# EAGLE design PDB (EAGLE 8.3.2)

## Sheet 1 of 2
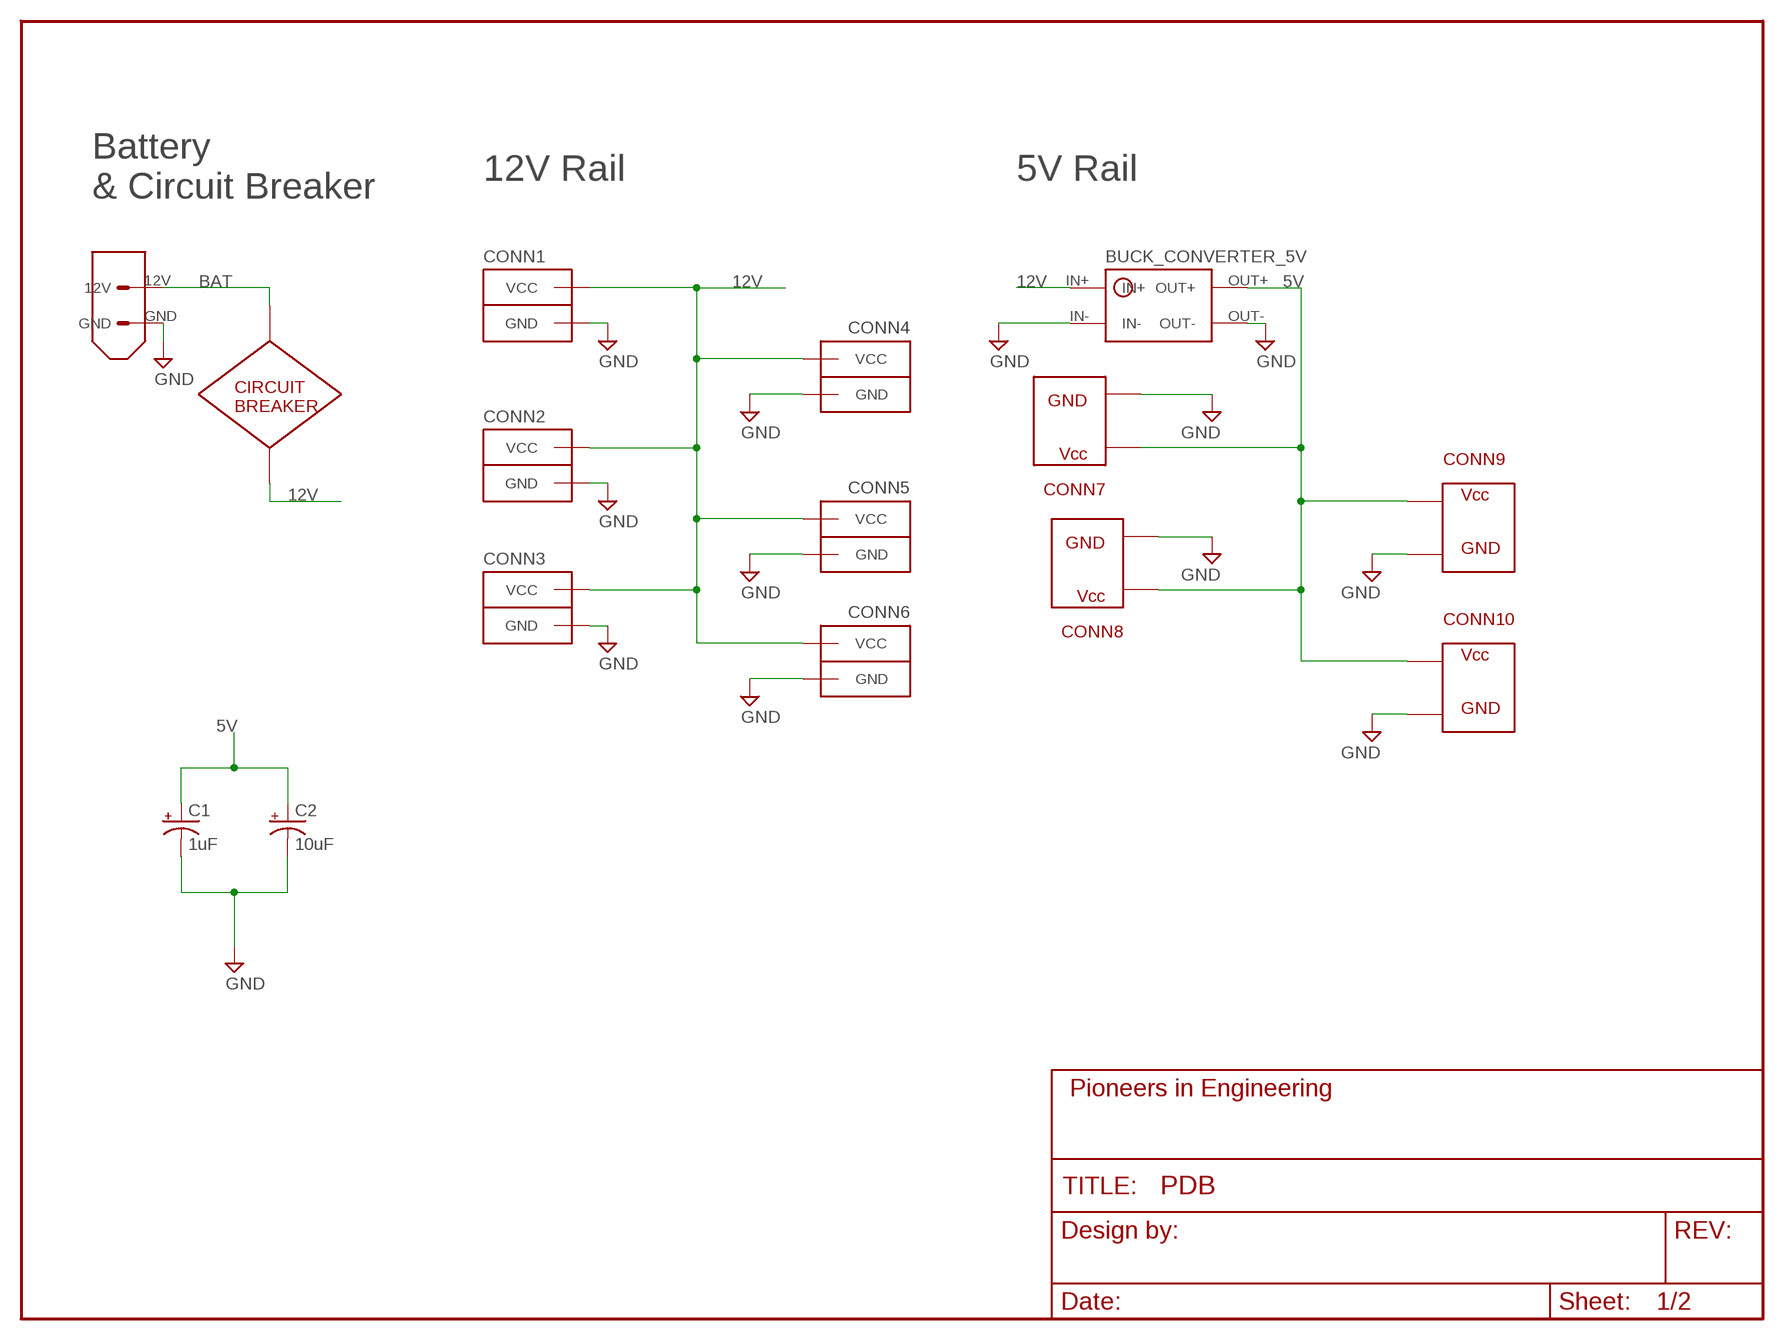
[diagram p0: schematic, sheet 1]
FRAME1 (FRAME_SCHEMATIC): AUTHOR: Mohammed H., Sharabesh R., Tobin H.; REVISION: 10C

### Parts
C1  1uF  CPOL-USE5-5  [E5-5]
C2  10uF  CPOL-USE5-5  [E5-5]
CIRCUIT_BREAKER  CIRC_BREAKER  [CIRC_BREAKER]
CONN1  ANDERSONVERTICAL  [ANDERSON_VERTICAL]
CONN2  ANDERSONVERTICAL  [ANDERSON_VERTICAL]
CONN3  ANDERSONVERTICAL  [ANDERSON_VERTICAL]
CONN4  ANDERSONVERTICAL  [ANDERSON_VERTICAL]
CONN5  ANDERSONVERTICAL  [ANDERSON_VERTICAL]
CONN6  ANDERSONVERTICAL  [ANDERSON_VERTICAL]
CONN7  ATX  [ATX]
CONN8  ATX  [ATX]
CONN9  ATX  [ATX]
CONN10  ATX  [ATX]
U$1  BUCK_CONVERTER_5V  [BUCK_CONVERTER_5V]
XT60  XT60CONNECTOR  [XT60CONNECTOR]

### Nets
5V: C1.+ C2.+ CONN7.P$1 CONN8.P$1 CONN9.P$1 CONN10.P$1 U$1.OUT+ ; also sheet 2
12V: CIRCUIT_BREAKER.P$2 CONN1.PIN2(VCC) CONN2.PIN2(VCC) CONN3.PIN2(VCC) CONN4.PIN2(VCC) CONN5.PIN2(VCC) CONN6.PIN2(VCC) U$1.IN+
BAT: CIRCUIT_BREAKER.P$1 XT60.12V
GND: C1.- C2.- CONN1.PIN1(GND) CONN2.PIN1(GND) CONN3.PIN1(GND) CONN4.PIN1(GND) CONN5.PIN1(GND) CONN6.PIN1(GND) CONN7.P$2 CONN8.P$2 CONN9.P$2 CONN10.P$2 U$1.IN- U$1.OUT- XT60.GND ; also sheet 2

### Notes on the sheet
- 12V Rail | 5V Rail
- Battery
  & Circuit Breaker

## Sheet 2 of 2
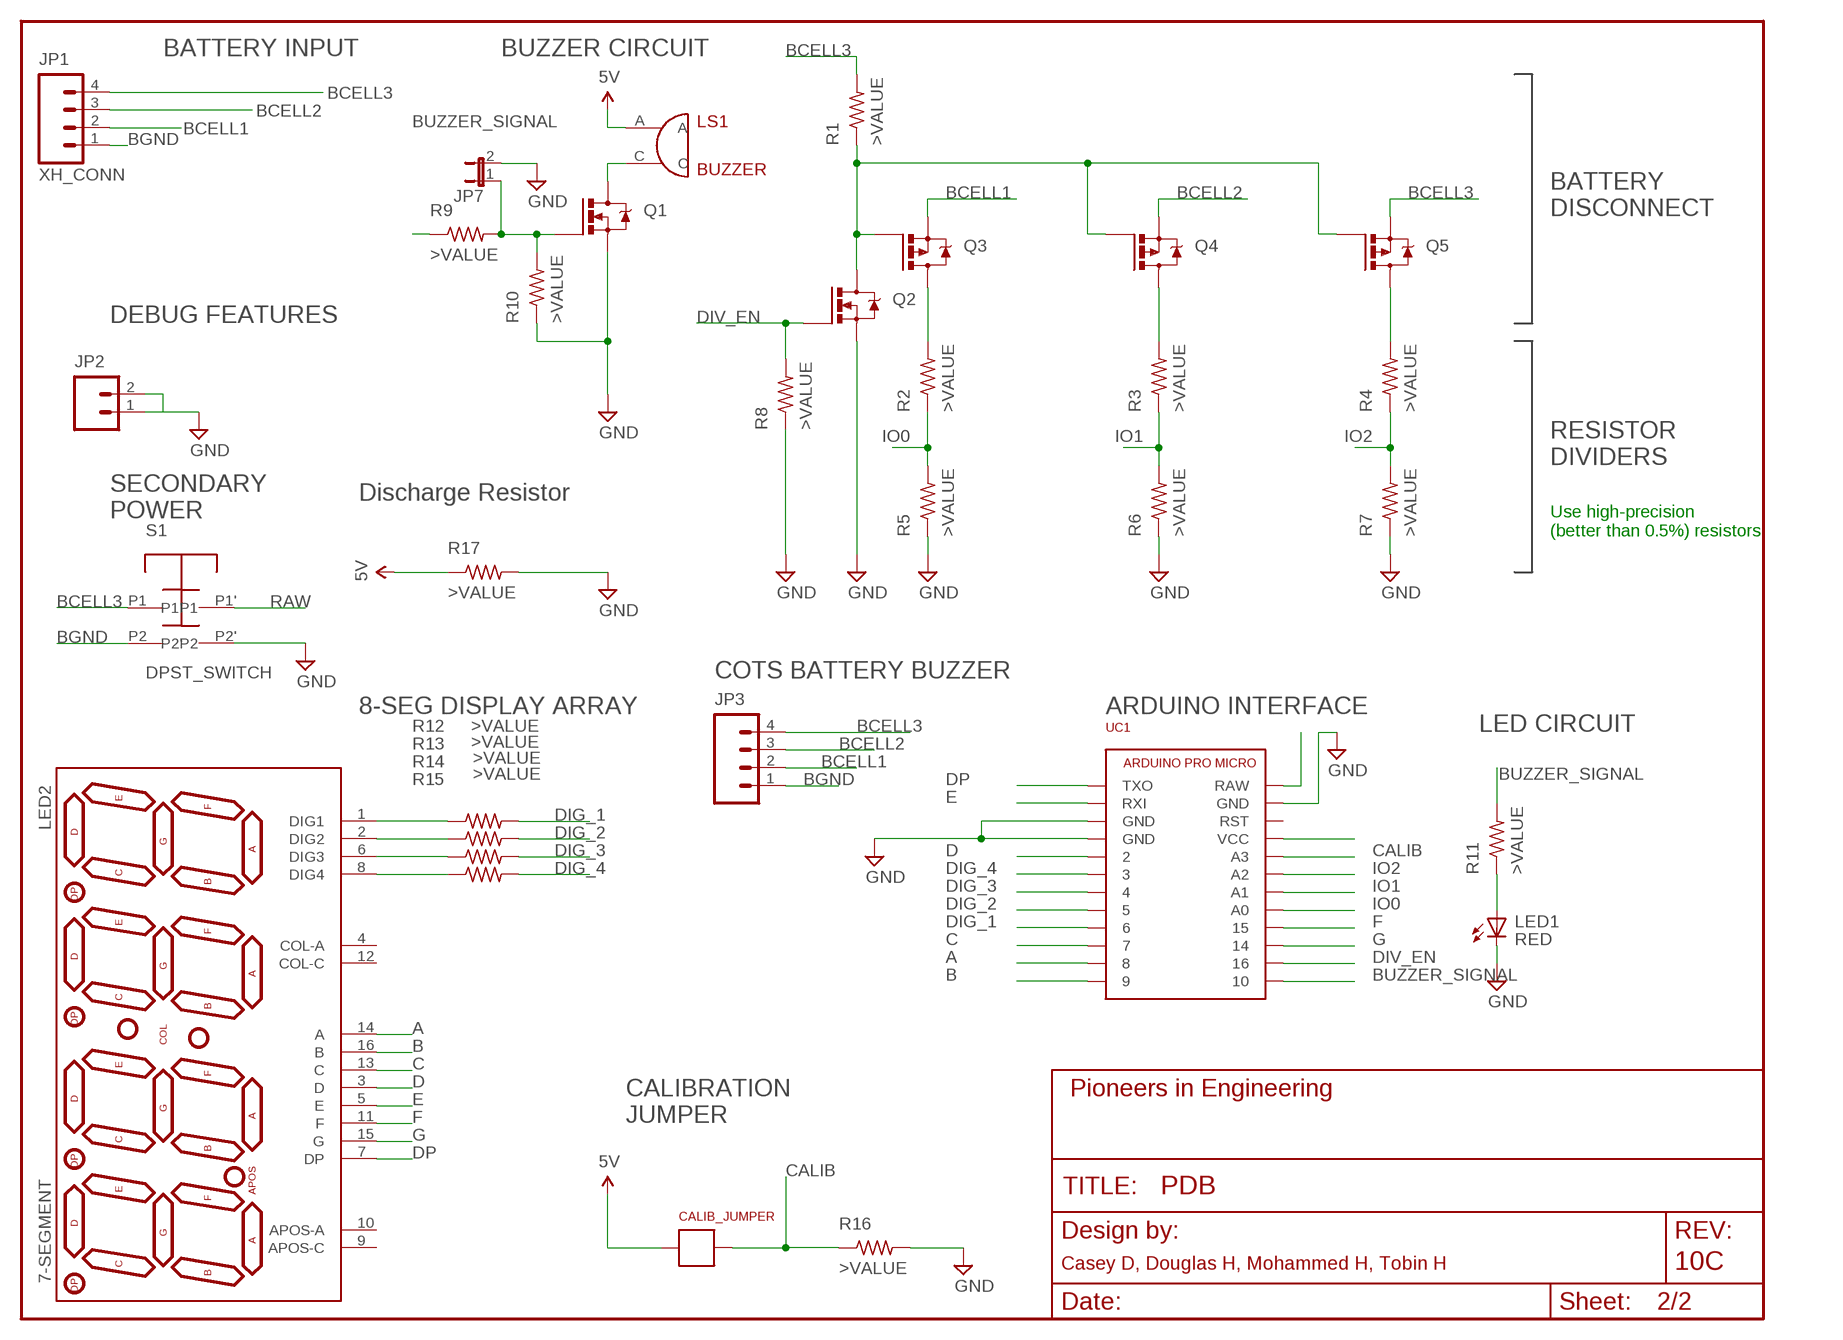
[diagram p1: schematic, sheet 2]
FRAME2 (FRAME_SCHEMATIC): AUTHOR: Casey D, Douglas H, Mohammed H, Tobin H; REVISION: 10C

### Parts
CALIB_JUMPER  JUMPER  [JUMPER]
JP1  XH_CONN  XH_CONNECTOR_4POS  [XH_CONNECTOR_4POS_2.5MM]
JP2  M02PTH  [1X02]
JP3  M04PTH  [1X04]
JP7  JP1E  [JP1]
LED1  RED  LED0805  [LED-0805]
LED2  7-SEGMENT  7-SEGMENT-4DIGIT-YOUNGSUN  [7-SEGMENT-4DIGIT-YOUNGSUN]
LS1  BUZZER  [BUZZER_MAGNETIC_5V_12MM_RADIAL]
Q1  NMOS  N-CHANNEL-MOSFETSOT23-3  [SOT23-3]
Q2  IRFML8244  N-CHANNEL-MOSFETSOT23-3  [SOT23-3]
Q3  PMOS  P-CHANNEL-MOSFETSOT23-3  [SOT23-3]
Q4  PMOS  P-CHANNEL-MOSFETSOT23-3  [SOT23-3]
Q5  PMOS  P-CHANNEL-MOSFETSOT23-3  [SOT23-3]
R1  >VALUE  R-US_R0603  [R0603]
R2  >VALUE  R-US_R0603  [R0603]
R3  >VALUE  R-US_R0603  [R0603]
R4  >VALUE  R-US_R0603  [R0603]
R5  >VALUE  R-US_R0603  [R0603]
R6  >VALUE  R-US_R0603  [R0603]
R7  >VALUE  R-US_R0603  [R0603]
R8  >VALUE  R-US_R0603  [R0603]
R9  >VALUE  R-US_R0603  [R0603]
R10  >VALUE  R-US_R0603  [R0603]
R11  >VALUE  R-US_R0603  [R0603]
R12  >VALUE  R-US_R0603  [R0603]
R13  >VALUE  R-US_R0603  [R0603]
R14  >VALUE  R-US_R0603  [R0603]
R15  >VALUE  R-US_R0603  [R0603]
R16  >VALUE  R-US_R0603  [R0603]
R17  >VALUE  R-US_R0603  [R0603]
S1  DPST_SWITCH  [C&K_SWITCH]
UC1  ARDUINO_PRO_MICRO  [ARDUINO_PRO_MICRO]

### Nets
5V: CALIB_JUMPER.P$1 LS1.A R17.1 UC1.VCC ; also sheet 1
A: LED2.14(A) UC1.8
B: LED2.16(B) UC1.9
BCELL1: JP1.2 JP3.2 Q3.2(S)
BCELL2: JP1.3 JP3.3 Q4.2(S)
BCELL3: JP1.4 JP3.4 Q5.2(S) R1.2 S1.P1
BGND: JP1.1 JP3.1 S1.P2
BUZZER_SIGNAL: R9.1 R11.2 UC1.10
C: LED2.13(C) UC1.7
CALIB: CALIB_JUMPER.P$2 R16.1 UC1.A3
D: LED2.3(D) UC1.2
DIG_1: R12.2 UC1.6
DIG_2: R13.2 UC1.5
DIG_3: R14.2 UC1.4
DIG_4: R15.2 UC1.3
DIV_EN: Q2.1(G) R8.2 UC1.16
DP: LED2.7(DP) UC1.TXO
E: LED2.5(E) UC1.RXI
F: LED2.11(F) UC1.15
G: LED2.15(G) UC1.14
GND: JP2.1 JP2.2 JP7.2 LED1.C Q1.2(S) Q2.2(S) R5.1 R6.1 R7.1 R8.1 R10.1 R16.2 R17.2 S1.P2' UC1.GND@0(GND) UC1.GND@1(GND) UC1.GND@2(GND) ; also sheet 1
IO0: R2.1 R5.2 UC1.A0
IO1: R3.1 R6.2 UC1.A1
IO2: R4.1 R7.2 UC1.A2
N$1: Q2.3(D) Q3.1(G) Q4.1(G) Q5.1(G) R1.1
N$2: Q3.3(D) R2.2
N$3: Q4.3(D) R3.2
N$4: Q5.3(D) R4.2
N$5: LS1.C Q1.3(D)
N$6: JP7.1 Q1.1(G) R9.2 R10.2
N$7: LED1.A R11.1
N$9: LED2.1(DIG1) R12.1
N$11: LED2.2(DIG2) R13.1
N$13: LED2.6(DIG3) R14.1
N$15: LED2.8(DIG4) R15.1
RAW: S1.P1' UC1.RAW
Unconnected: LED2.4(COL-A) LED2.9(APOS-C) LED2.10(APOS-A) LED2.12(COL-C) UC1.RST

### Notes on the sheet
- BATTERY INPUT | BUZZER CIRCUIT
- BATTERY
  DISCONNECT
- DEBUG FEATURES
- RESISTOR
  DIVIDERS
- Discharge Resistor
- SECONDARY
  POWER
- Use high-precision
  (better than 0.5%) resistors
- COTS BATTERY BUZZER
- 8-SEG DISPLAY ARRAY | ARDUINO INTERFACE
- Connect BCELL3 to RAW, which
  will get regulated on the arduino.
- LED CIRCUIT
- CALIBRATION
  JUMPER

## Library data of the parts
C1 C2 = rcl:CPOL-US: POLARIZED CAPACITOR, American symbol
CALIB_JUMPER = pie:JUMPER: 2 Pin Jumper; DESCRIPTION: JUMPER; DISTRIBUTOR: DigiKey; DISTRIBUTOR_PART_NUMBER: 952-2262-ND; MANUFACTURER: Harwin. Inc; MANUFACTURER_PART_NUMBER: M20-9990246; PACKAGE: JP
CIRCUIT_BREAKER = pie:CIRC_BREAKER: PiE Circuit Breaker: product page <http://www.waytekwire.com/item/46977/Bussmann-25550-B-2-Mid-Range-Circuit-Breaker-/>; MANUF: WAYTEK; MANUF-PN: 46977
CONN1-CONN6 = pie:ANDERSON: 2-pin 25A Anderson Connector http://www.alliedelec.com/images/products/datasheets/bm/ANDERSON_POWER_PRODUCTS/70162018.pdf; PIE-INT-REF-NUM: Anderson
CONN7-CONN10 = pie:ATX: ATX 2 Pin Connector Crimper: http://www.digikey.com/product-detail/en/molex-llc/0640160204/WM17553-ND/2074099 Housing: http://www.digikey.com/product-detail/en/molex-llc/0019092029/WM4382-ND/2421313 Housing (alternative): http://www.digikey.com/product-detail/en/molex-llc/0015311026/WM1041-ND/313614 Connector: http://www.digikey.com/product-detail/en/molex-llc/0019091029/WM1602-ND/26354 Male crimps: http://www.digikey.com/product-detail/en/molex-llc/0002092103/WM1100-ND/26384 Female crimps: http://www.digikey.com/product-detail/en/molex-llc/0002091104/WM1101-ND/26386
JP1 = pie:XH_CONNECTOR_4POS: 4-pin XH connector (through-hole type shrouded header); PIE-INT-REF-NUM: XH-4POS; PIE_DIGIKEY-PN: 455-2249-ND
JP2 = pie:M02: 2-pin 0.1-inch header and MTA connector; PIE-INT-REF-NUM: BULK-STOCK
JP3 = pie:M04: 4-pin 0.1-inch header and MTA connector; PIE-INT-REF-NUM: BULK-STOCK
JP7 = jumper:JP1E: JUMPER
LED1 = pie:LED: LEDs Standard schematic elements and footprints for 5mm, 3mm, 1206, and 0603 sized LEDs. 5mm - Spark Fun Electronics SKU : COM-00529 (and others); PIE-INT-REF-NUM: LED
LED2 = pie:7-SEGMENT-4DIGIT-YOUNGSUN: This is a part for the 4-Digit 7-segment LEDs from Young Sun. Different from the Digikey LEDs, all 16 pins are used. The LONGPADS Variant is used for a test jig, but you may like it because there is more pad to solder to. If you are concerned about routing space, the standard works just fine though.
LS1 = pie:BUZZER: Buzzer; PIE-INT-REF-NUM: BUZZER; PIE_DIGIKEY-PN: 102-1269-ND
Q1 Q2 = pie:N-CHANNEL-MOSFET: N-channel TrenchMOS (TM) logic level FET Source: SOT23-3: http://www.nxp.com/documents/data_sheet/BSS123.pdf SOT669: http://www.nxp.com/documents/data_sheet/PH7030L.pdf
Q3-Q5 = pie:P-CHANNEL-MOSFET: P-Channel PowerTrench® MOSFET Source: FDD4141.pdf; PIE-DIGIKEY-PN-PRI: IRLML6402PBFCT-ND; PIE-INT-REF-NUM: PMOS
R1-R17 = pie:R-US_: RESISTOR, American symbol; DESCRIPTION: RESISTOR, American symbol; DISTRIBUTOR: DigiKey; MANUFACTURER: Rohm Semiconductor; NOTES: Cut Tape; PACKAGE: R0603
S1 = pie:DPST_SWITCH: Double Throw, single pole normally open pushbutton switch. 401-1133-ND
U$1 = pie:BUCK_CONVERTER_5V: 5V Buck Converter. For PDB. Product Detail <https://www.amazon.com/dp/B00GQ032DK/?psc=1>
UC1 = pie:ARDUINO_PRO_MICRO: Arduino Pro Micro Electrical System Year 9's Smart Sensor Core Pin Outs <https://cdn.sparkfun.com/assets/9/c/3/c/4/523a1765757b7f5c6e8b4567.png> Buy Here <http://www.aliexpress.com/item/Mini-Leonardo-Pro-Micro-ATmega32U4-5V-16MHz-Module-For-Arduino-Best-Quality/32284746884.html?ws_ab_test=searchweb201556_8,searchweb201602_2_10057_10056_10065_10055_10054_10067_10069_10059_10058_10017_10070_10060_10061_10052_10062_10053_10050_10051,searchweb201603_1&btsid=45993952-29ca-4de4-a0fb-c7fb72b8e1a5> Thru Hole Female Pins <http://www.digikey.com/product-search/en?keywords=929974E-01-12-ND> Surface Mount Female Pins <http://www.digikey.com/product-detail/en/sullins-connector-solutions/NPTC121KFXC-RC/S5604-ND/776062>; DESCRIPTION: Arduino Pro Micro; DISTRIBUTOR: AliExpress; DISTRIBUTOR_PART_NUMBER: 32284746884; MANUFACTURER: Feiyang electronics; NOTES: https://www.aliexpress.com/item/Mini-Leonardo-Pro-Micro-ATmega32U4-5V-16MHz-Module-For-Arduino-Best-Quality/32284746884.html?ws_ab_test=searchweb201556_8,searchweb201602_2_10057_10056_10065_10055_10054_10067_10069_10059_10058_10017_10070_10060_10061_10052_10062_10053_10050_10051,searchweb201603_1&btsid=45993952-29ca-4de4-a0fb-c7fb72b8e1a5; PACKAGE: ARDUINO_PRO_MICRO; REFERENCE_DEST: ARDUINO_PRO_MICRO
XT60 = pie:XT60CONNECTOR: 12V XT60 power connector; PARTNUMBER: PRT-10474

## Board
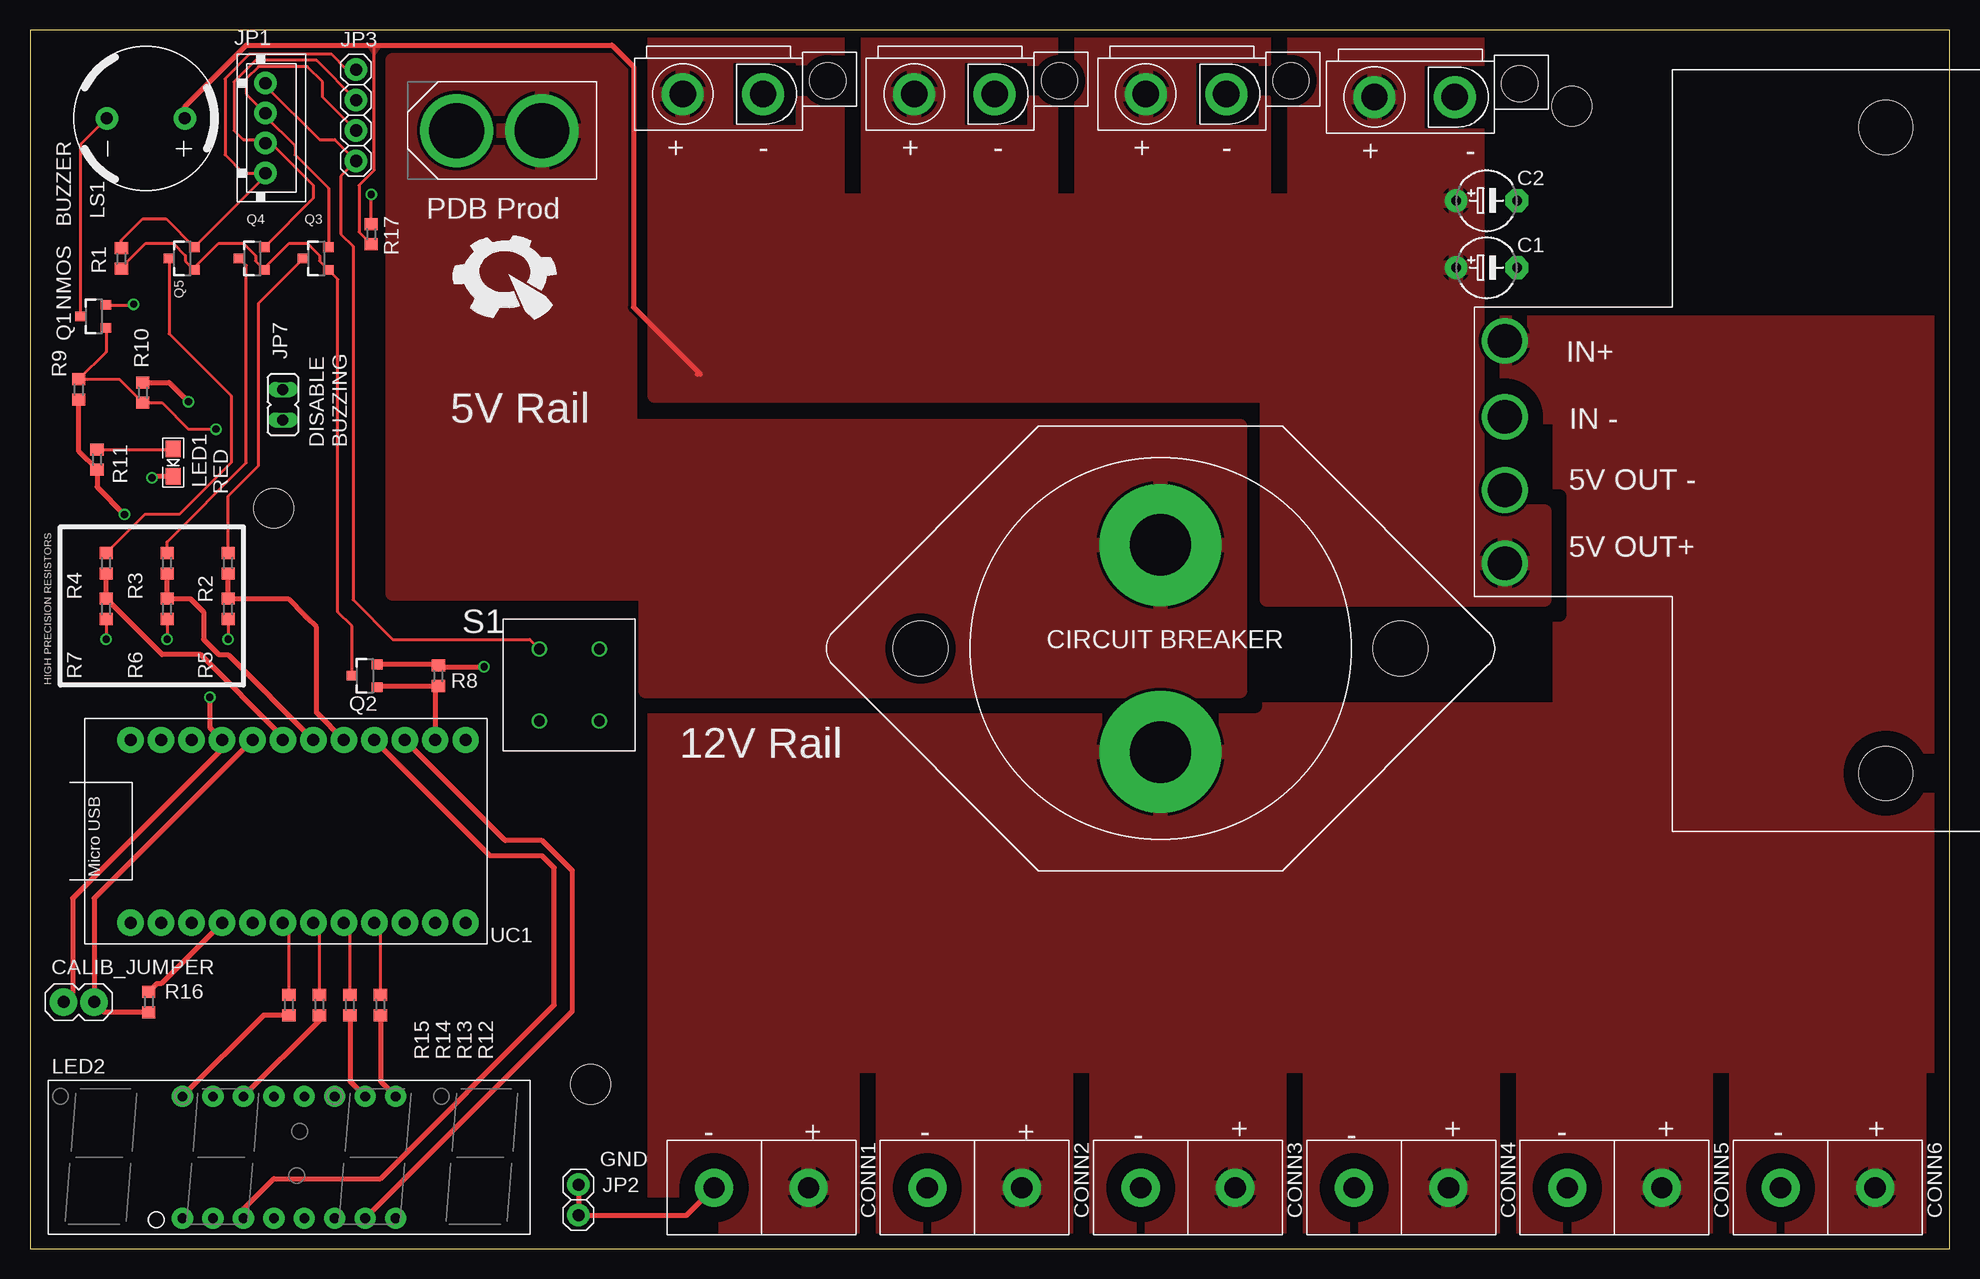
[diagram p2: board, top side]
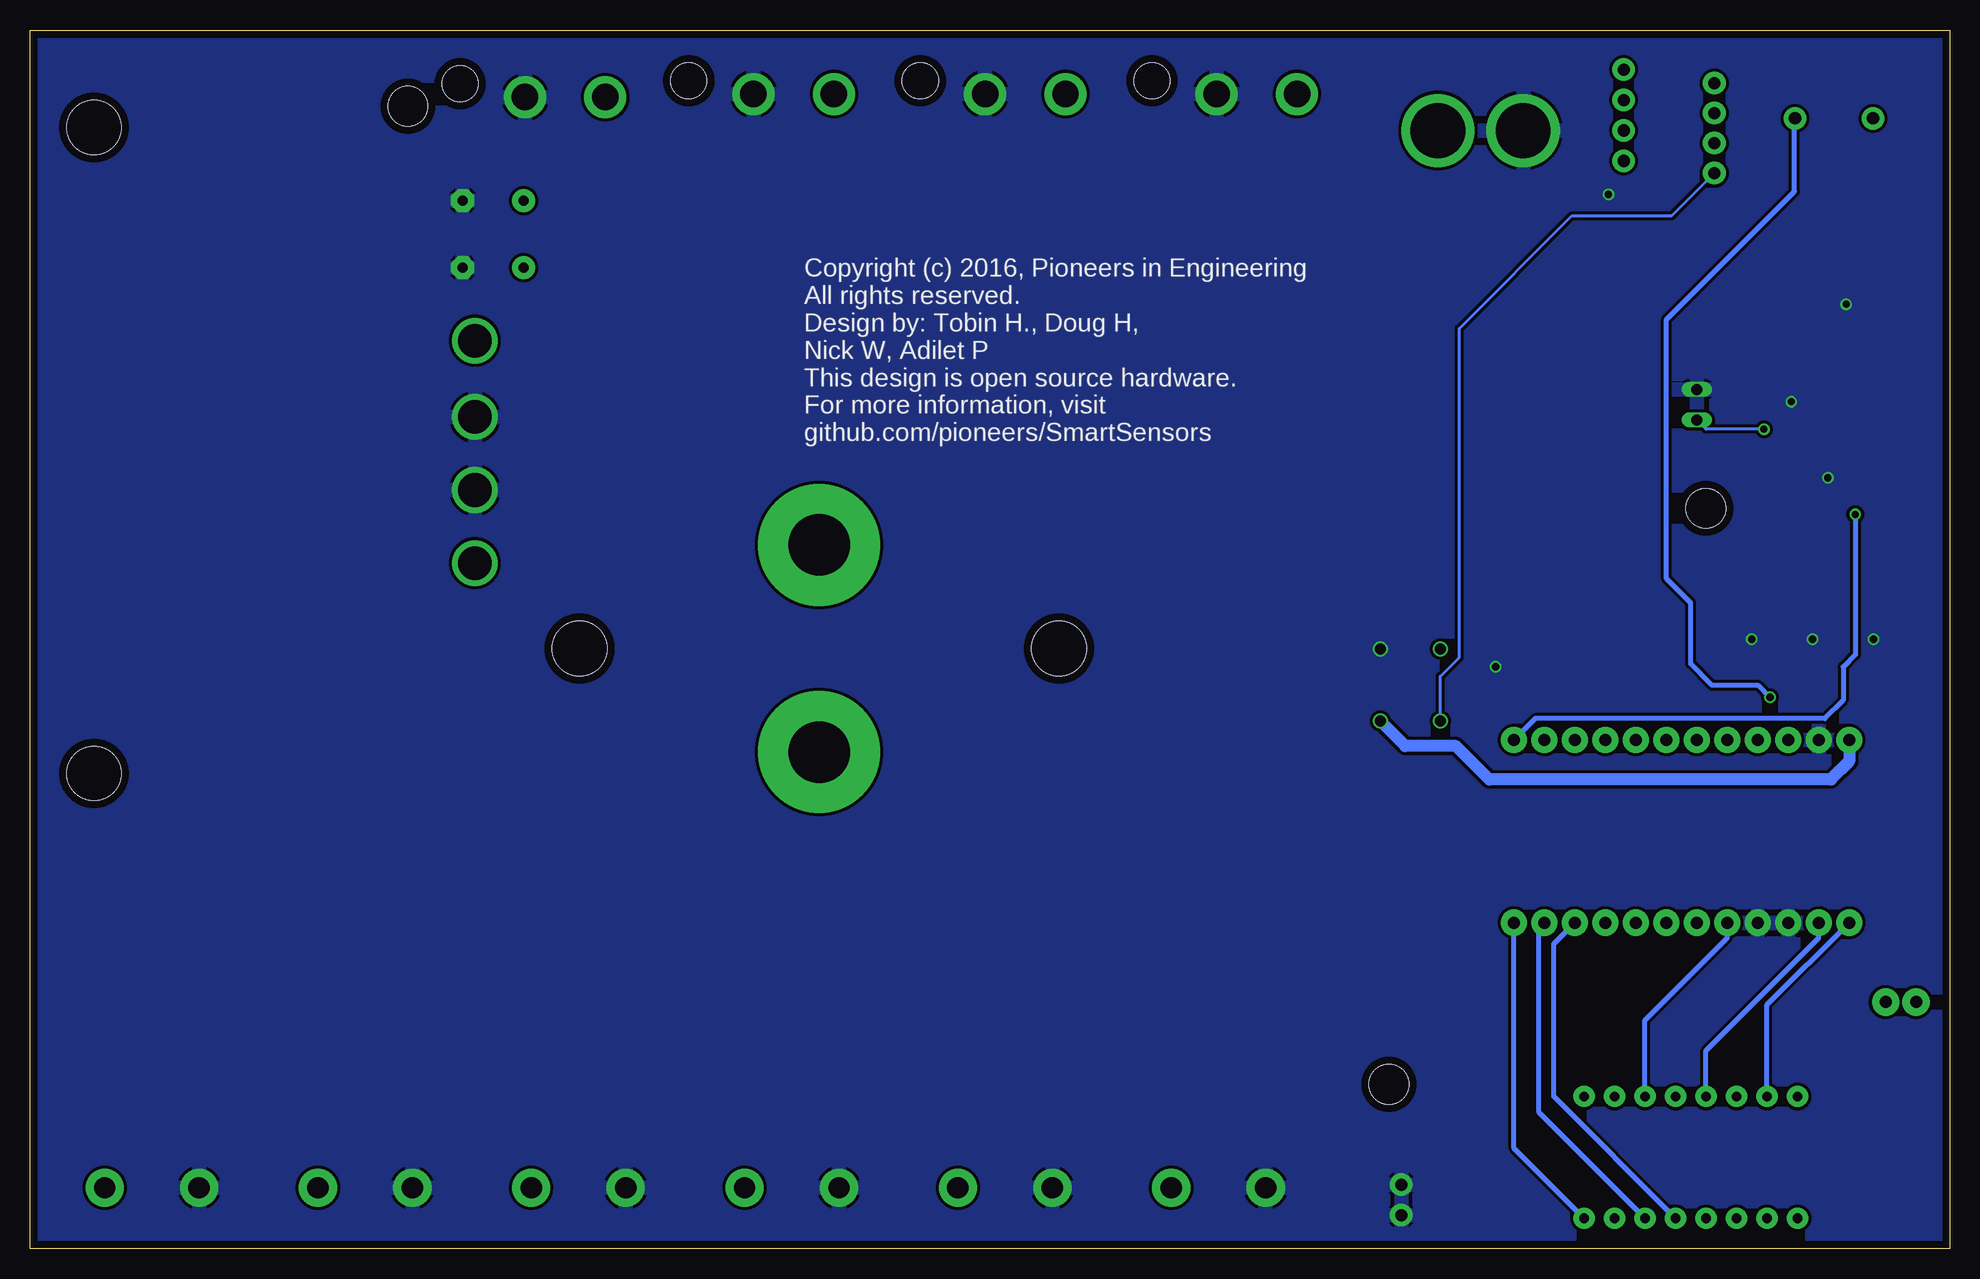
[diagram p3: board, bottom side, seen from below]

Size 160.02 x 101.6 mm. Coordinates in mm from the lower left corner, seen from the top.
Outline: 0,0 160.02,0 160.02,101.6 0,101.6 0,0
Copper layers (1*16): Top 2mil / dielectric 9mil / Bottom 2mil
Design rules "pie-2oz": minimum track width 10mil, minimum drill 15mil, track to track 10mil, track to pad 10mil, pad to pad 10mil, via to via 10mil, smd to smd 10mil, copper to edge 25mil, drill to drill 10mil, minimum pad ring 7mil, minimum via ring 7mil, stop-mask expansion 3mil, vias tented up to drill 21mil, thermal gap 10mil

### Footprints (pad centres in the part's own frame; a part is rotated, then mirrored left to right if it is on the bottom)
E5-5 = drill 0.813 pad 1.905: + -2.54,0 | drill 0.813 pad 1.905 octagon: - 2.54,0
JUMPER = drill 1 pad 2.286: P$1 -1.27,0; P$2 1.27,0
CIRC_BREAKER = drill 5.105 pad 10.16: P$1 0,8.636; P$2 0,-8.636 | hole 4.572: -19.99,0; 19.99,0
ANDERSON_VERTICAL = drill 1.778 pad 3.175: PIN1 0,-3.937; PIN2 0,3.937
ATX = drill 2.2 pad 3.5: P$1 -3,0; P$2 3.7,0 | hole 3: 9.1,1.1
XH_CONNECTOR_4POS_2.5MM = drill 1.016 pad 1.88: 1 -3.95,-0.19; 2 -1.45,-0.19; 3 1.05,-0.19; 4 3.55,-0.19
1X02 = drill 1.016 pad 1.88: 1 -1.27,0; 2 1.27,0
1X04 = drill 1.016 pad 1.88: 1 -3.81,0; 2 -1.27,0; 3 1.27,0; 4 3.81,0
JP1 = drill 0.914 long: 1 0,-1.27; 2 0,1.27
LED-0805 = smd 1.397 x 1.245: A -1.143,0; C 1.143,0
7-SEGMENT-4DIGIT-YOUNGSUN = drill 0.8 pad 1.778: 1 -8.89,-5.08; 2 -6.35,-5.08; 3 -3.81,-5.08; 4 -1.27,-5.08; 5 1.27,-5.08; 6 3.81,-5.08; 7 6.35,-5.08; 8 8.89,-5.08; 9 8.89,5.08; 10 6.35,5.08; 11 3.81,5.08; 12 1.27,5.08; 13 -1.27,5.08; 14 -3.81,5.08; 15 -6.35,5.08; 16 -8.89,5.08
BUZZER_MAGNETIC_5V_12MM_RADIAL = drill 1.016 pad 1.88: A 0,3.25; C 0,-3.25
SOT23-3 = smd 0.8 x 0.9: 1 -0.95,-1; 2 0.95,-1; 3 0,1.1
R0603 = smd 1 x 1.1: 1 -0.85,0; 2 0.85,0
C&K_SWITCH = drill 0.9: P1 -3,2.5; P1' -3,-2.5; P2 3,2.5; P2' 3,-2.5
BUCK_CONVERTER_5V = drill 2.8 pad 3.81: IN+ 9.144,31.75; IN- 2.794,31.75; OUT+ -9.398,31.75; OUT- -3.302,31.75 | hole 4.496: -26.924,0; 26.924,0
STAND-OFF = hole 3.302: 0,0
ARDUINO_PRO_MICRO = drill 1 pad 2.184: 2 1.778,19.558; 3 1.778,17.018; 4 1.778,14.478; 5 1.778,11.938; 6 1.778,9.398; 7 1.778,6.858; 8 1.778,4.318; 9 1.778,1.778; 10 17.018,1.778; 14 17.018,6.858; 15 17.018,9.398; 16 17.018,4.318; A0 17.018,11.938; A1 17.018,14.478; A2 17.018,17.018; A3 17.018,19.558; GND@0 1.778,24.638; GND@1 1.778,22.098; GND@2 17.018,27.178; RAW 17.018,29.718; RST 17.018,24.638; RXI 1.778,27.178; TXO 1.778,29.718; VCC 17.018,22.098
XT60CONNECTOR = drill 4.572 pad 6.096: 12V -3.556,0; GND 3.556,0

### Placement (x,y rotation side)
C1  121.41,81.79 0 top
C2  121.41,87.38 0 top
CALIB_JUMPER  4.06,20.57 0 top
CIRCUIT_BREAKER  94.23,50.04 0 top
CONN1  60.96,5.08 270 top
CONN2  78.74,5.08 270 top
CONN3  96.52,5.08 270 top
CONN4  114.3,5.08 270 top
CONN5  132.08,5.08 270 top
CONN6  149.86,5.08 270 top
CONN7  57.4,96.27 0 top
CONN8  96.01,96.27 0 top
CONN9  76.71,96.27 0 top
CONN10  115.06,96.01 0 top
JP1  19.81,93.22 270 top
JP2  45.72,4.06 90 top
JP3  27.18,94.49 90 top
JP7  21.08,70.36 0 top
LED1  11.94,65.53 270 top
LED2  21.59,7.62 180 top
LS1  9.65,94.23 270 top
Q1  5.33,77.72 90 top
Q2  27.94,47.75 90 top
Q3  23.88,82.55 90 top
Q4  18.54,82.55 90 top
Q5  12.7,82.55 90 top
R1  10k  [R0603]  7.62,82.55 90 top
R2  10k  [R0603]  16.51,57.15 90 top
R3  30k  [R0603]  11.43,57.15 90 top
R4  51k  [R0603]  6.35,57.15 90 top
R5  10k  [R0603]  16.51,53.34 90 top
R6  10k  [R0603]  11.43,53.34 90 top
R7  10k  [R0603]  6.35,53.34 90 top
R8  10k  [R0603]  34.04,47.75 270 top
R9  1k  [R0603]  4.06,71.63 90 top
R10  100k  [R0603]  9.4,71.37 270 top
R11  130  [R0603]  5.59,65.79 270 top
R12  330  [R0603]  29.21,20.32 90 top
R13  330  [R0603]  26.67,20.32 90 top
R14  330  [R0603]  24.13,20.32 90 top
R15  330  [R0603]  21.59,20.32 90 top
R16  10k  [R0603]  9.91,20.57 90 top
R17  3k  [R0603]  28.45,84.58 90 top
S1  44.96,46.99 90 top
U$1  154.69,66.55 90 top
U$2  [STAND-OFF]  46.74,13.72 0 top
U$4  [STAND-OFF]  128.52,95.25 90 top
U$5  [STAND-OFF]  20.32,61.72 0 top
U$6  [PIE-LOGO-SMALL]  39.88,81.28 0 top
UC1  38.1,25.4 90 top
XT60  39.12,93.22 180 top

### Tracks (layer width: path | path; a pad name or v marks a point on that pad's centre or on a via)
5V  (via drill 0.6)
  Top 0.254: R17.1 27.43,84.75 27.43,88.65 28.7,89.92 28.7,100.33
  Top 0.406: LS1.A 12.9,95.2 18.03,100.33 28.7,100.33 48.51,100.33 50.29,98.55 50.29,78.49 55.88,72.9 55.63,72.9 | v14.99,45.97 14.99,43.43 UC1.VCC 16,41.66 3.56,29.21 3.56,21.34 CALIB_JUMPER.P$1
  Bottom 0.406: LS1.A 12.95,94.18 12.95,88.14 23.62,77.47 23.62,55.88 21.59,53.85 21.59,48.77 19.81,46.99 16,46.99 v14.99,45.97
  pour Top: 52.07,87.38 120.65,87.38 120.65,61.47 126.24,61.47 126.24,54.1 103.12,54.1 103.12,71.12 52.07,71.12
  pour Top: 28.19,100.33 28.7,99.57 29.21,100.33
  pour Top: 52.07,101.6 67.31,101.6 67.31,85.34 52.07,85.34
  pour Top: 87.63,101.6 87.63,85.34 102.87,85.34 102.87,101.6
  pour Top: 69.85,101.6 69.85,85.34 85.09,85.34 85.09,101.6
  pour Top: 105.41,101.6 105.41,85.34 120.65,85.34 120.65,101.6
12V
  pour Top (isolate 1.27, rank 2): 52.07,44.96 127.51,44.96 127.51,69.34 121.92,69.34 121.92,77.22 158.75,77.22 158.75,15.24 52.07,15.24
  pour Top (isolate 1.27): 52.07,16.51 68.58,16.51 68.58,1.27 52.07,1.27
  pour Top (isolate 1.27): 106.68,1.27 121.92,1.27 121.92,16.51 106.68,16.51
  pour Top (isolate 1.27): 71.12,16.51 86.36,16.51 86.36,1.27 71.12,1.27
  pour Top (isolate 1.27): 124.46,1.27 139.7,1.27 139.7,16.51 124.46,16.51
  pour Top (isolate 1.27): 88.9,16.51 104.14,16.51 104.14,1.27 88.9,1.27
  pour Top (isolate 1.27): 142.24,1.27 157.48,1.27 157.48,16.51 142.24,16.51
A
  Bottom 0.406: UC1.8 33.78,26.92 34.29,26.42 34.29,11.43 LED2.14
B
  Bottom 0.406: LED2.16 36.32,8.38 UC1.9
BAT
  pour Top: 50.04,99.06 50.04,68.58 100.84,68.58 100.84,46.48 51.31,46.48 51.31,54.61 30.23,54.61 30.23,99.06
BCELL1
  Top 0.254: Q3.2 24.89,83.52 24.89,88.39 22.1,91.19 22.1,91.95 19.62,94.42 JP1.2 18.03,96.26 18.03,97.54 19.05,98.55 23.11,98.55 24.38,97.28 24.38,96.01 JP3.2
BCELL2
  Top 0.254: Q4.2 23.62,87.58 23.62,88.65 20.1,92.17 JP1.3 19.33,92.46 17.78,92.46 17.02,93.22 17.02,97.28 18.8,99.06 23.88,99.06 JP3.3
BCELL3
  Top 0.254: Q5.2 19.62,89.42 JP1.4 17.78,89.66 16.26,91.19 16.26,97.54 18.29,99.57 25.15,99.57 26.42,98.3 JP3.4 | R1.2 7.62,84.07 9.4,85.85 11.35,85.85 Q5.2 | 13.72,83.52 Q5.2
  Bottom 0.254: S1.P1 42.46,47.71 40.89,49.28 40.89,76.71 31.5,86.11 23.18,86.11 JP1.4
BGND
  Top 0.254: JP1.1 19.62,96.96 24.13,92.46 25.4,92.46 JP3.1 25.91,89.41 25.91,84.58 26.92,83.57 26.92,54.1 30.23,50.8 41.65,50.8 S1.P2
BUZZER_SIGNAL  (via drill 0.6)
  Top 0.406: R9.1 4.06,66.46 R11.2 5.59,63.5 v7.87,61.21
  Bottom 0.406: v7.87,61.21 7.87,49.53 8.89,48.51 8.89,45.72 10.41,44.2 34.54,44.2 UC1.10
C
  Bottom 0.406: LED2.13 33.02,12.7 33.02,25.4 UC1.7
CALIB
  Top 0.406: UC1.A3 5.33,29.21 CALIB_JUMPER.P$2 6.18,19.72 R16.1
D
  Bottom 0.406: LED2.3 25.4,19.05 18.54,25.91 UC1.2
DIG_1
  Top 0.254: R12.2 29.21,26.67 UC1.6
DIG_2
  Top 0.254: R13.2 26.67,26.67 UC1.5
DIG_3
  Top 0.254: R14.2 24.13,26.67 UC1.4
DIG_4
  Top 0.254: R15.2 21.59,26.67 UC1.3
DIV_EN
  Top 0.406: Q2.1 29.04,46.9 R8.2 33.78,46.65 UC1.16
DP
  Bottom 0.406: LED2.7 15.24,20.32 UC1.TXO
E
  Bottom 0.406: LED2.5 20.32,16.51 10.92,25.91 UC1.RXI
F
  Top 0.406: LED2.11 17.78,3.3 20.32,5.84 29.21,5.84 43.69,20.32 43.69,31.75 42.67,32.77 38.35,32.77 UC1.15
G
  Top 0.406: LED2.15 45.21,19.81 45.21,31.5 42.67,34.04 39.62,34.04 UC1.14
GND  (via drill 0.6)
  Top 0.254: R7.1 v6.35,50.8 | R6.1 v11.43,50.8 | 33.94,48.7 R8.1 | Q1.2 8.57,78.67 v8.64,78.74 | R17.2 v28.45,87.88 | R5.1 v16.51,50.8
  Top 0.406: JP2.2 JP2.1 54.74,2.79 CONN1.PIN1 | R8.1 34.12,48.51 v37.85,48.51 | 33.94,48.7 Q2.2 | LED1.C 10.16,64.39 v10.16,64.26 | R10.1 11.6,72.22 v13.21,70.61 | UC1.GND@1 10.92,22.1 10.58,22.1 R16.2
  pour Bottom (rank 6): 0,101.6 159.77,101.6 160.02,0 0,0
IO0
  Top 0.406: R2.1 R5.2 21.5,54.19 22.86,52.83 23.11,52.58 23.88,51.82 23.88,44.7 UC1.A0
IO1
  Top 0.406: R3.1 R6.2 13.37,54.19 14.48,53.09 14.48,50.8 15.75,49.53 16.51,49.53 UC1.A1
IO2
  Top 0.406: R4.1 R7.2 11.01,49.53 14.22,49.53 21.08,42.67 UC1.A2
N$1
  Top 0.254: Q2.3 26.84,51.9 25.65,53.09 25.65,80.82 Q3.1 24.13,82.35 24.13,82.8 23.11,83.82 21.59,83.82 19.54,81.77 Q4.1 18.8,82.35 18.8,82.8 17.78,83.82 15.75,83.82 13.7,81.77 Q5.1 12.95,82.35 12.95,82.8 11.94,83.82 9.65,83.82 7.62,81.79 R1.1
N$2
  Top 0.254: R2.2 16.51,62.74 19.05,65.28 19.05,78.82 Q3.3
N$3
  Top 0.254: R3.2 11.43,58.93 18.03,65.53 18.03,81.96 Q4.3
N$4
  Top 0.254: Q5.3 11.6,76.28 16.76,71.12 16.76,65.53 12.45,61.21 9.56,61.21 R4.2
N$5
  Top 0.254: Q1.3 4.23,92.07 LS1.C
N$6  (via drill 0.6)
  Top 0.254: Q1.1 6.33,74.75 R9.2 7.44,72.48 R10.2 11.01,70.52 13.21,68.33 v15.49,68.33
  Bottom 0.254: v15.49,68.33 20.32,68.33 JP7.1
N$7
  Top 0.254: R11.1 11.88,66.64 11.88,66.67 LED1.A
N$9
  Top 0.406: R12.1 29.21,13.97 LED2.1
N$11
  Top 0.406: R13.1 26.67,13.97 LED2.2
N$13
  Top 0.406: R14.1 24.13,19.05 LED2.6
N$15
  Top 0.406: R15.1 19.47,19.47 LED2.8
RAW
  Bottom 1.016: UC1.RAW 8.38,40.64 9.91,39.12 38.35,39.12 41.15,41.91 45.38,41.91 S1.P1'

### Text on the board
tPlace: + | - | + | - | + | - | + | - | PDB Prod | IN+ | 5V Rail | IN - | 5V OUT - | 5V OUT+ | 12V Rail | - | + | - | + | - | + | - | + | - | + | - | +
bPlace: Copyright (c) 2016, Pioneers in Engineering / All rights reserved. / Design by: Tobin H., Doug H, / Nick W, Adilet P / This design is open source hardware. / For more information, visit / github.com/pioneers/SmartSensors
tNames: DISABLE / BUZZING | HIGH PRECISION RESISTORS | GND